# EAGLE design plc-3u-b-r1 (EAGLE 5.09)
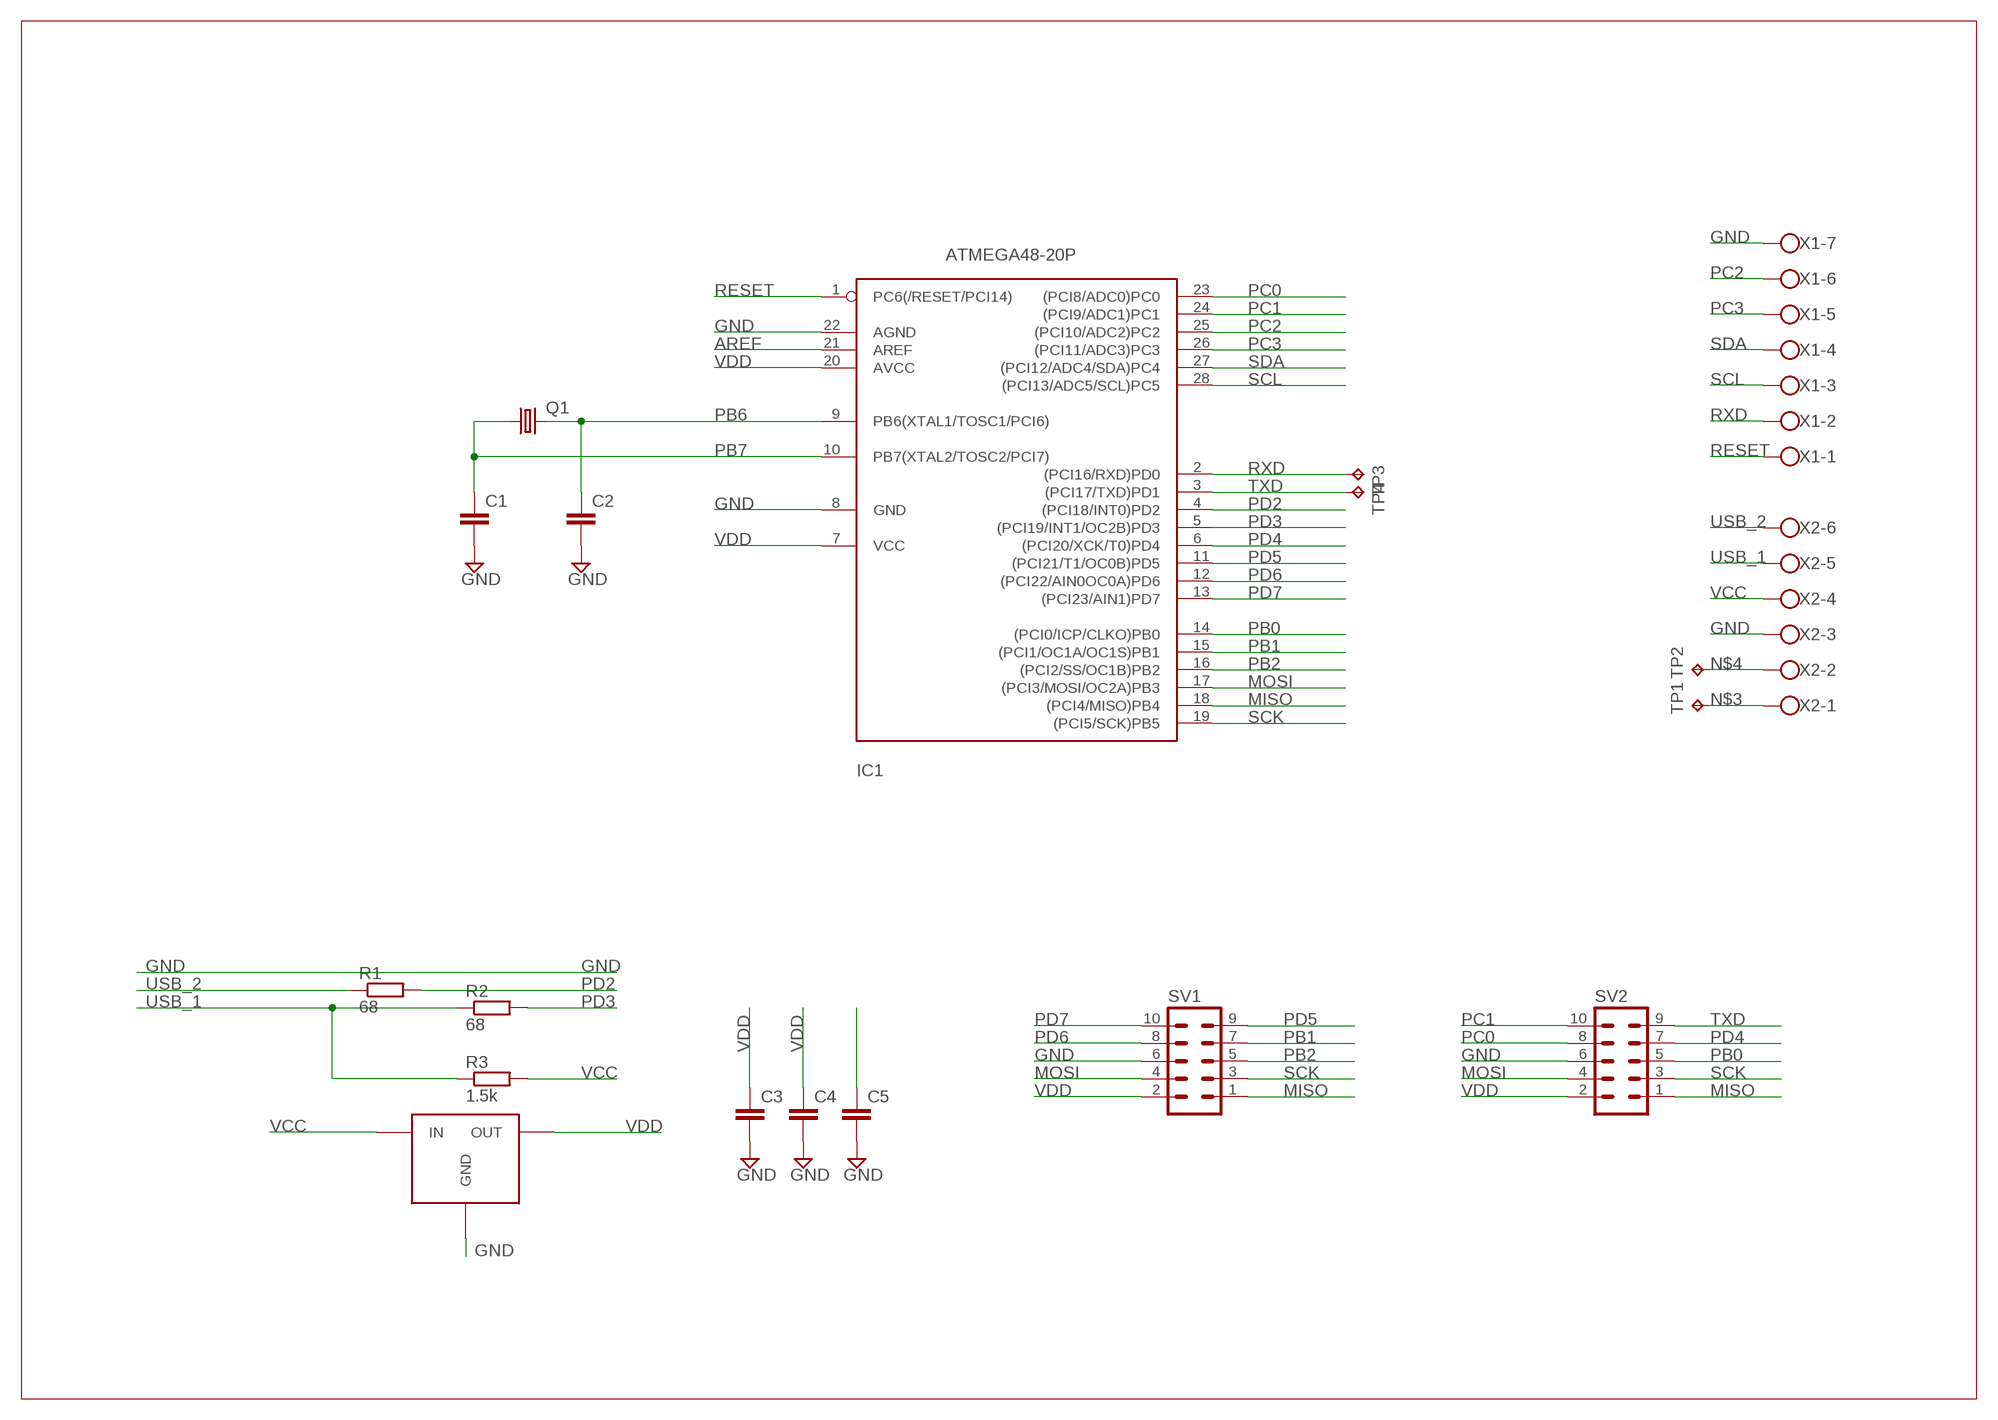
[diagram p0: schematic, sheet 1]

## Parts
C1  C-EUC0805  [C0805]
C2  C-EUC0805  [C0805]
C3  C-EUC1206  [C1206]
C4  C-EUC1206  [C1206]
C5  C-EUC1206  [C1206]
IC1  ATMEGA48-20P  [DIL28-3]
Q1  CRYSTALHC49S  [HC49/S]
R1  68  R-EU_R0805  [R0805]
R2  68  R-EU_R0805  [R0805]
R3  1.5k  R-EU_R0805  [R0805]
SV1  MA05-2  [MA05-2]
SV2  MA05-2  [MA05-2]
TP1  TPPAD1-13  [P1-13]
TP2  TPPAD1-13  [P1-13]
TP3  TPPAD1-13  [P1-13]
TP4  TPPAD1-13  [P1-13]
U$1  LF33CDT  [TO-252]
X1  W237-07P  [W237-7P]
X2  W237-06P  [W237-6P]

## Nets
AREF: IC1.21(AREF)
GND: C1.2 C2.2 C3.2 C4.2 C5.2 IC1.8(GND) IC1.22(AGND) SV1.6 SV2.6 U$1.3(GND) X1.7 X2.3
MISO: IC1.18((PCI4/MISO)PB4) SV1.1 SV2.1
MOSI: IC1.17((PCI3/MOSI/OC2A)PB3) SV1.4 SV2.4
N$1: C5.1
N$3: TP1.TP X2.1
N$4: TP2.TP X2.2
PB0: IC1.14((PCI0/ICP/CLKO)PB0) SV2.5
PB1: IC1.15((PCI1/OC1A/OC1S)PB1) SV1.7
PB2: IC1.16((PCI2/SS/OC1B)PB2) SV1.5
PB6: C2.1 IC1.9(PB6(XTAL1/TOSC1/PCI6)) Q1.2
PB7: C1.1 IC1.10(PB7(XTAL2/TOSC2/PCI7)) Q1.1
PC0: IC1.23((PCI8/ADC0)PC0) SV2.8
PC1: IC1.24((PCI9/ADC1)PC1) SV2.10
PC2: IC1.25((PCI10/ADC2)PC2) X1.6
PC3: IC1.26((PCI11/ADC3)PC3) X1.5
PD2: IC1.4((PCI18/INT0)PD2) R1.2
PD3: IC1.5((PCI19/INT1/OC2B)PD3) R2.2
PD4: IC1.6((PCI20/XCK/T0)PD4) SV2.7
PD5: IC1.11((PCI21/T1/OC0B)PD5) SV1.9
PD6: IC1.12((PCI22/AIN0OC0A)PD6) SV1.8
PD7: IC1.13((PCI23/AIN1)PD7) SV1.10
RESET: IC1.1(PC6(/RESET/PCI14)) X1.1
RXD: IC1.2((PCI16/RXD)PD0) TP3.TP X1.2
SCK: IC1.19((PCI5/SCK)PB5) SV1.3 SV2.3
SCL: IC1.28((PCI13/ADC5/SCL)PC5) X1.3
SDA: IC1.27((PCI12/ADC4/SDA)PC4) X1.4
TXD: IC1.3((PCI17/TXD)PD1) SV2.9 TP4.TP
USB_1: R2.1 R3.1 X2.5
USB_2: R1.1 X2.6
VCC: R3.2 U$1.1(IN) X2.4
VDD: C3.1 C4.1 IC1.7(VCC) IC1.20(AVCC) SV1.2 SV2.2 U$1.2(OUT)

## Library data of the parts
C1-C5 = rcl:C-EU: CAPACITOR, European symbol
IC1 = avr:ATMEGA48*P: MICROCONTROLLER 4 Kbytes FLASH 512 Bytes SRAM 256 Bytes EEPROM USART 8-channel 10 bit ADC
Q1 = crystal:CRYSTAL: CRYSTAL
R1-R3 = rcl:R-EU_: RESISTOR, European symbol
SV1 SV2 = con-lstb:MA05-2: PIN HEADER
TP1-TP4 = testpad:TP: Test pad
U$1 = my-to252:LF33CDT
X1 = con-wago-508:W237-07P: WAGO SREW CLAMP
X2 = con-wago-508:W237-06P: WAGO SREW CLAMP

## Board
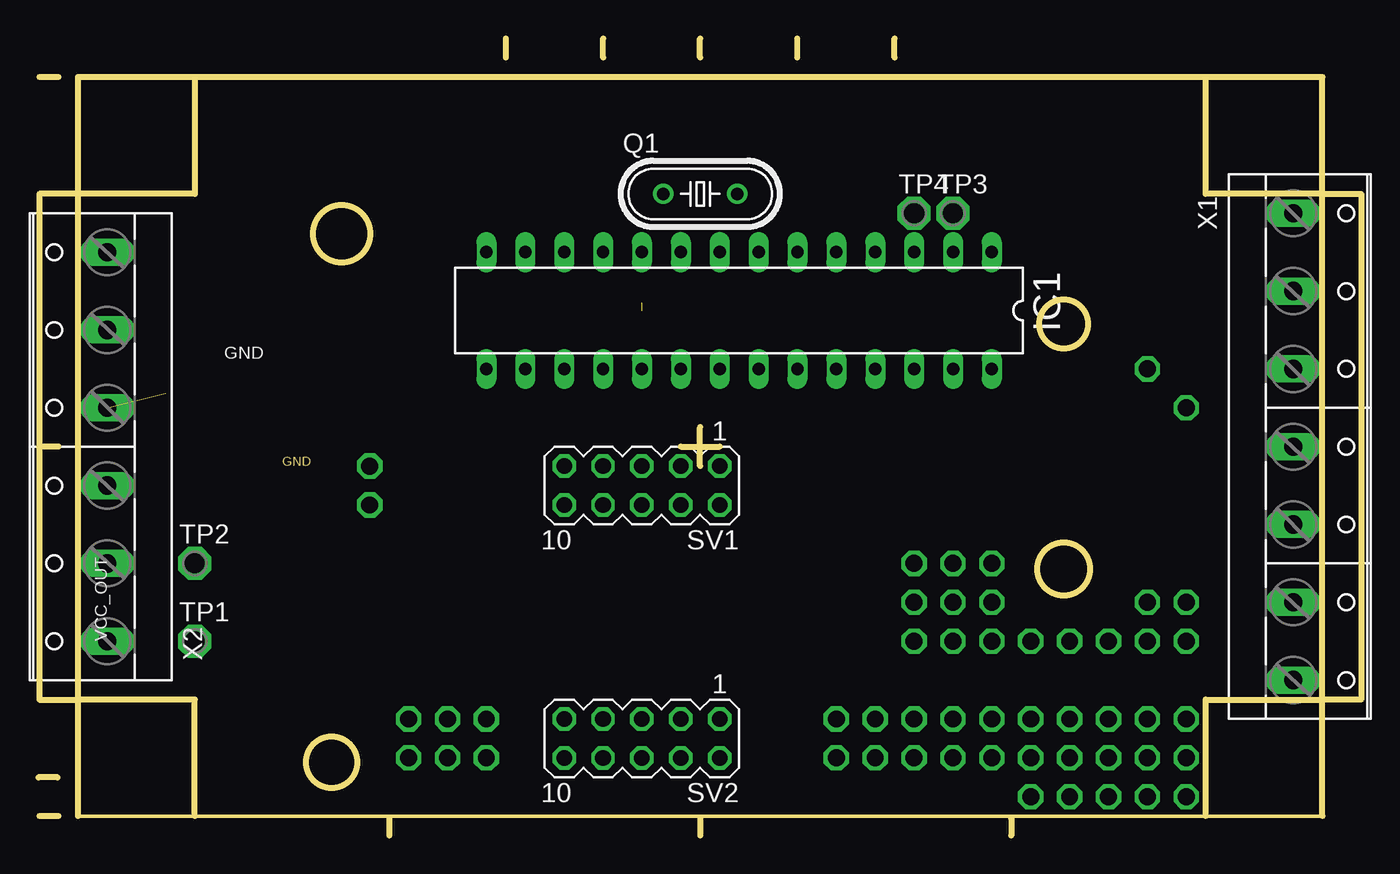
[diagram p1: board, top side]
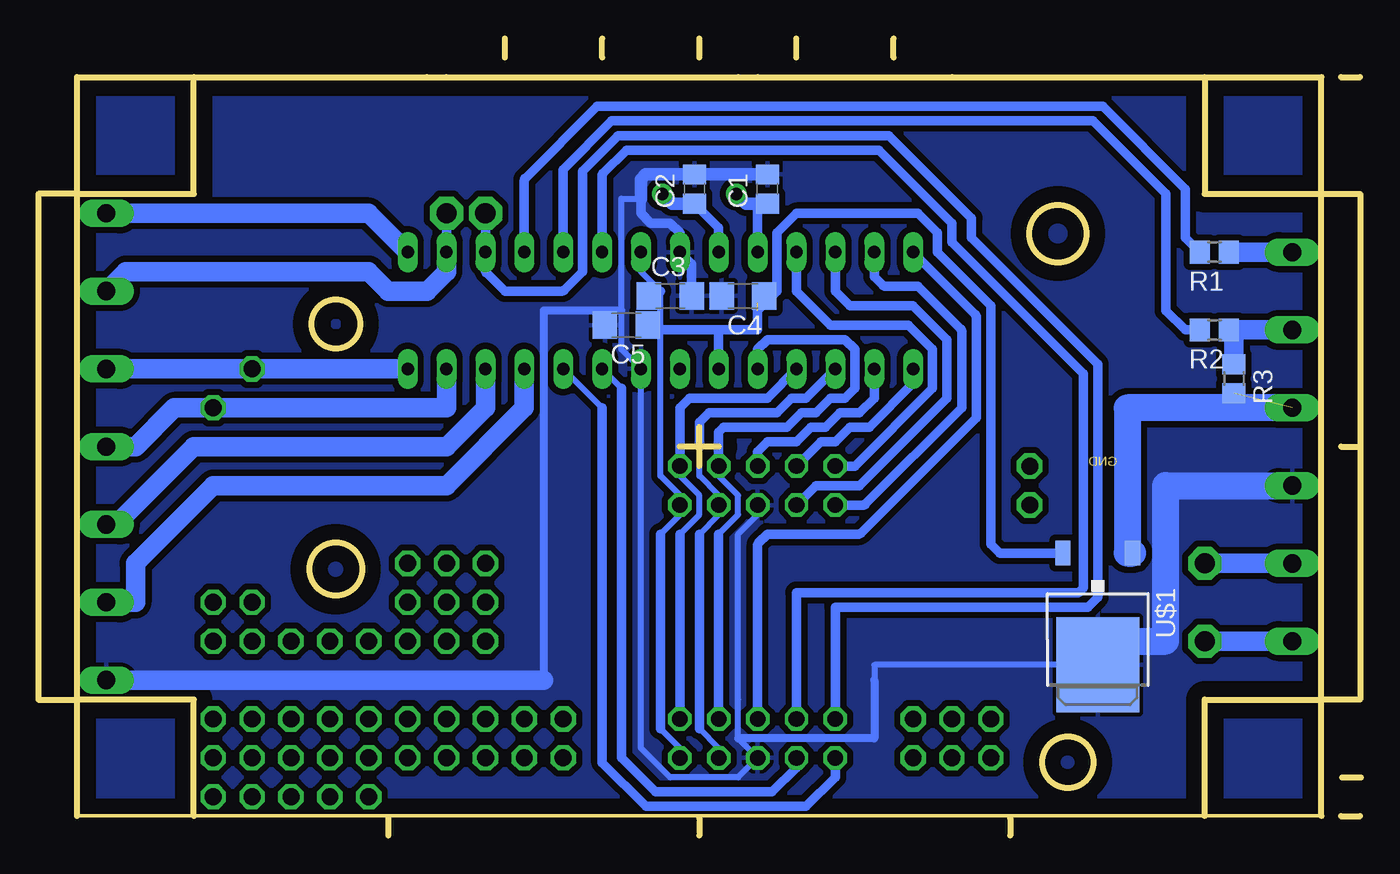
[diagram p2: board, bottom side, seen from below]

Size 86.42 x 52.07 mm. Coordinates in mm from the lower left corner, seen from the top.
Outline: 2.6,1.29 83.89,1.25
Outline: 43.24,1.13 43.24,0
Outline: 1.33,49.53 0.06,49.53
Outline: 1.33,1.27 0.06,1.27
Outline: 1.33,25.4 0.06,25.4
Outline: 41.97,25.4 44.51,25.4
Outline: 43.24,24.13 43.24,26.67
Outline: 2.6,1.27 2.6,8.89
Outline: 2.6,8.89 2.6,41.91
Outline: 2.6,41.91 2.6,49.53 10.22,49.53
Outline: 83.89,1.27 83.89,8.89
Outline: 83.89,8.89 83.89,41.91
Outline: 83.89,41.91 83.89,49.53 76.27,49.53
Outline: 76.27,49.53 61.02,49.53 59.75,49.53 40.7,49.53 39.43,49.53 26.73,49.53 10.22,49.53
Outline: 10.22,1.27 10.22,8.89 2.6,8.89
Outline: 76.27,1.27 76.27,8.89 83.89,8.89
Outline: 83.89,41.91 76.27,41.91 76.27,49.53
Outline: 10.22,49.53 10.22,41.91 2.6,41.91
Outline: 2.6,41.91 0.06,41.91 0.06,8.89 2.6,8.89
Outline: 83.89,41.91 86.42,41.91 86.42,8.89 83.89,8.89
Outline: 43.24,50.8 43.24,52.07
Outline: 49.59,50.8 49.59,52.07
Outline: 55.95,50.8 55.95,52.07
Outline: 36.89,50.8 36.89,52.07
Outline: 30.55,50.8 30.55,52.07
Outline: 1.27,3.81 0,3.81
Outline: 22.93,1.13 22.93,0
Outline: 63.56,1.13 63.56,0
Outline: circle at 19.81,39.32 radius 1.86
Outline: circle at 19.18,4.8 radius 1.66
Outline: circle at 67,17.4 radius 1.71
Outline: circle at 67,33.4 radius 1.57
Copper layers (1*16): Top 0.035mm / dielectric 1.5mm / Bottom 0.035mm
Design rules "default": minimum track width 10mil, minimum drill 24mil, track to track 8mil, track to pad 8mil, pad to pad 8mil, via to via 8mil, smd to smd 8mil, copper to edge 40mil, drill to drill 8mil, minimum pad ring 10mil, minimum via ring 8mil, stop-mask expansion 4mil, vias tented up to drill 0mil, thermal gap 10mil

### Footprints (pad centres in the part's own frame; a part is rotated, then mirrored left to right if it is on the bottom)
C0805 = smd 1.3 x 1.5: 1 -0.95,0; 2 0.95,0
C1206 = smd 1.6 x 1.8: 1 -1.4,0; 2 1.4,0
DIL28-3 = drill 0.813 long: 1 -16.51,-3.81; 2 -13.97,-3.81; 3 -11.43,-3.81; 4 -8.89,-3.81; 5 -6.35,-3.81; 6 -3.81,-3.81; 7 -1.27,-3.81; 8 1.27,-3.81; 9 3.81,-3.81; 10 6.35,-3.81; 11 8.89,-3.81; 12 11.43,-3.81; 13 13.97,-3.81; 14 16.51,-3.81; 15 16.51,3.81; 16 13.97,3.81; 17 11.43,3.81; 18 8.89,3.81; 19 6.35,3.81; 20 3.81,3.81; 21 1.27,3.81; 22 -1.27,3.81; 23 -3.81,3.81; 24 -6.35,3.81; 25 -8.89,3.81; 26 -11.43,3.81; 27 -13.97,3.81; 28 -16.51,3.81
HC49/S = drill 0.813 round: 1 -2.413,0; 2 2.413,0
R0805 = smd 1.3 x 1.5: 1 -0.95,0; 2 0.95,0
MA05-2 = drill 1.016 octagon: 1 -5.08,-1.27; 2 -5.08,1.27; 3 -2.54,-1.27; 4 -2.54,1.27; 5 0,-1.27; 6 0,1.27; 7 2.54,-1.27; 8 2.54,1.27; 9 5.08,-1.27; 10 5.08,1.27
P1-13 = drill 1.321 pad 2.159 octagon: TP 0,0
TO-252 = smd 1 x 1.6: 1 -2.28,-6.07; 2 2.28,-6.07 | smd 5.4 x 6.2: 3 0,1.23
W237-7P = drill 1.194 long: 1 -15.24,-0.635; 2 -10.16,-0.635; 3 -5.08,-0.635; 4 0,-0.635; 5 5.08,-0.635; 6 10.16,-0.635; 7 15.24,-0.635
W237-6P = drill 1.194 long: 1 -12.7,-0.635; 2 -7.62,-0.635; 3 -2.54,-0.635; 4 2.54,-0.635; 5 7.62,-0.635; 6 12.7,-0.635

### Placement (x,y rotation side)
C1  38.8,42.23 90 bottom
C2  43.56,42.23 90 bottom
C3  45.15,35.24 0 bottom
C4  40.39,35.24 180 bottom
C5  48.01,33.34 180 bottom
IC1  45.78,34.29 180 top
Q1  43.24,41.91 0 top
R1  9.59,38.1 180 bottom
R2  9.59,33.02 180 bottom
R3  8.32,29.84 270 bottom
SV1  39.43,22.86 180 top
SV2  39.43,6.35 180 top
TP1  10.22,12.7 0 top
TP2  10.22,17.78 0 top
TP3  59.75,40.64 0 top
TP4  57.21,40.64 0 top
U$1  17.21,12.38 180 bottom
X1  82.62,25.4 270 top
X2  3.88,25.4 90 top

### Tracks (layer width: path | path; a pad name or v marks a point on that pad's centre or on a via)
GND
  Bottom 0.406: SV1.6 39.43,20.95 40.7,19.68 40.7,8.89 40.7,6.35 SV2.6 40.7,3.81 45.15,3.81 47.05,5.71 IC1.22 48.32,31.75 48.32,34.29 48.32,41.59 47.05,41.59 | U$1.3 17.84,11.15 31.82,11.15 31.82,10.16
  Bottom 0.508: 53.4,10.16 53.4,34.29 49.59,34.29 | 49.59,34.29 48.32,34.29 49.59,34.29 | 31.82,10.16 31.82,6.35 40.7,6.35
  Bottom 0.61: 47.05,41.59 47.05,40.64 46.42,40.01 45.15,40.01 44.51,39.37 IC1.8 43.75,37.34 C3.2
  Bottom 0.813: C1.2 C2.2 46.74,43.18 47.05,42.86 47.05,41.59
  Bottom 1.27: 53.4,10.16 X1.7
  Bottom 1.778: X2.3 12.77,22.86 12.77,13.97 12.77,12.7 17.84,12.7 17.84,11.15
  pour Bottom (isolate 0.406): 2.6,1.27 83.89,1.27 83.89,49.53 2.6,49.53
MISO
  Bottom 0.406: 44.51,19.68 43.24,20.95 43.24,22.23 44.51,23.5 SV1.1
  Bottom 0.61: SV2.1 44.51,19.68 | SV1.1 44.51,27.94 43.88,28.57 38.8,28.57 IC1.18
MOSI
  Bottom 0.406: SV2.4 41.97,5.71 43.24,6.99 | 43.24,19.68 41.97,20.95 SV1.4 41.97,22.23 43.24,23.5 43.24,25.4
  Bottom 0.61: 43.24,6.99 43.24,19.68 | 43.24,25.4 43.24,26.99 42.61,27.62 38.16,27.62 37.21,28.57 36.26,28.57 IC1.17
N$2  (via drill 1.1)
  other vias: 75,15.24
N$3
  Bottom 1.27: X2.1 TP1.TP
N$4
  Bottom 1.27: X2.2 TP2.TP
N$5  (via drill 1.1)
  other vias: 72.45,15.24
N$6  (via drill 1.1)
  other vias: 72.45,12.7
N$7  (via drill 1.1)
  other vias: 75,12.7
N$8  (via drill 1.1)
  other vias: 69.92,12.7
N$9  (via drill 1.1)
  other vias: 67.38,12.7
N$10  (via drill 1.1)
  other vias: 64.83,12.7
N$11  (via drill 1.1)
  other vias: 62.29,12.7
N$12  (via drill 1.1)
  other vias: 59.75,12.7
N$13  (via drill 1.1)
  other vias: 57.21,12.7
N$14  (via drill 1.1)
  other vias: 57.21,15.24
N$15  (via drill 1.1)
  other vias: 57.21,17.78
N$16  (via drill 1.1)
  other vias: 59.75,17.78
N$17  (via drill 1.1)
  other vias: 62.29,17.78
N$18  (via drill 1.1)
  other vias: 62.29,15.24
N$19  (via drill 1.1)
  other vias: 59.75,15.24
N$20  (via drill 1.1)
  other vias: 62.29,7.62
N$21  (via drill 1.1)
  other vias: 62.29,5.08
N$22  (via drill 1.1)
  other vias: 59.75,5.08
N$23  (via drill 1.1)
  other vias: 59.75,7.62
N$24  (via drill 1.1)
  other vias: 57.21,7.62
N$25  (via drill 1.1)
  other vias: 57.21,5.08
N$26  (via drill 1.1)
  other vias: 54.67,5.08
N$27  (via drill 1.1)
  other vias: 54.67,7.62
N$28  (via drill 1.1)
  other vias: 52.13,7.62
N$29  (via drill 1.1)
  other vias: 52.13,5.08
N$30  (via drill 1.1)
  other vias: 64.83,7.62
N$31  (via drill 1.1)
  other vias: 67.38,7.62
N$32  (via drill 1.1)
  other vias: 69.92,7.62
N$33  (via drill 1.1)
  other vias: 72.45,7.62
N$34  (via drill 1.1)
  other vias: 75,7.62
N$35  (via drill 1.1)
  other vias: 75,5.08
N$36  (via drill 1.1)
  other vias: 75,2.54
N$37  (via drill 1.1)
  other vias: 72.45,2.54
N$38  (via drill 1.1)
  other vias: 69.92,2.54
N$39  (via drill 1.1)
  other vias: 67.38,2.54
N$40  (via drill 1.1)
  other vias: 64.83,2.54
N$41  (via drill 1.1)
  other vias: 64.83,5.08
N$42  (via drill 1.1)
  other vias: 67.38,5.08
N$43  (via drill 1.1)
  other vias: 69.92,5.08
N$44  (via drill 1.1)
  other vias: 72.45,5.08
N$45  (via drill 1.1)
  other vias: 29.28,7.62
N$46  (via drill 1.1)
  other vias: 26.73,7.62
N$47  (via drill 1.1)
  other vias: 24.2,7.62
N$48  (via drill 1.1)
  other vias: 24.2,5.08
N$49  (via drill 1.1)
  other vias: 26.73,5.08
N$50  (via drill 1.1)
  other vias: 29.28,5.08
N$51  (via drill 1.1)
  other vias: 21.66,21.59
N$52  (via drill 1.1)
  other vias: 21.66,24.13
PB0
  Bottom 0.61: SV2.5 39.43,18.95 arc45 39.36,19.12 38.8,19.68 32.87,19.68 arc-45 32.69,19.76 25.15,27.3 25.15,33.87 arc-45 25.22,34.05 IC1.14
PB1
  Bottom 0.61: SV1.7 35.31,25.72 34.35,25.72 33.4,26.67 32.13,26.67 29.28,29.53 IC1.15
PB2
  Bottom 0.61: SV1.5 39.43,25.08 38.8,25.72 36.89,25.72 35.94,26.67 34.99,26.67 34.04,27.62 32.77,27.62 31.82,28.57 IC1.16
PB6
  Bottom 0.61: IC1.9 41.97,39.69 C2.1
  Bottom 0.813: C2.1 45.02,41.28 Q1.2
PB7
  Bottom 0.61: IC1.10 39.43,41.28
  Bottom 0.813: C1.1 39.43,41.28 40.2,41.28 Q1.1
PC0
  Bottom 0.406: 48.32,29.21 IC1.23
  Bottom 0.61: 48.32,29.21 48.32,5.08 46.1,2.86 38.48,2.86 36.89,4.45 SV2.8
PC1
  Bottom 0.406: 49.59,27.94 IC1.24
  Bottom 0.61: 49.59,27.94 49.59,4.76 46.74,1.91 36.26,1.91 34.35,3.81 SV2.10
PC2
  Bottom 1.27: IC1.25 54.67,27.94 59.75,22.86 75,22.86 80.08,17.78 80.08,15.24 X1.6
PC3
  Bottom 1.27: IC1.26 57.21,27.94 59.75,25.4 76.27,25.4 81.34,20.32 X1.5
PD2
  Bottom 0.61: IC1.4 54.67,42.76 arc45 54.6,42.94 49.91,47.62 16.89,47.62 11.5,42.23 11.5,39.05 R1.2
PD3
  Bottom 0.61: IC1.5 52.13,43.5 48.96,46.67 17.53,46.67 12.77,41.91 12.77,34.29 11.5,33.02 R2.2
PD4
  Bottom 0.61: IC1.6 49.59,43.08 arc45 49.52,43.25 48.01,44.77 31.5,44.77 26.73,40.01 26.73,38.73 18.16,30.16 18.16,29.21 18.16,16.19 18.48,15.88 22.61,15.88 36.89,15.88 SV2.7
PD5
  Bottom 0.61: SV1.9 33.09,24.13 28,29.21 28,31.75 29.59,33.34 34.67,33.34 36.89,35.56 IC1.11
PD6
  Bottom 0.61: SV1.8 35.62,22.86 32.77,22.86 27.05,28.57 27.05,32.38 29.28,34.61 33.4,34.61 34.35,35.56 IC1.12
PD7
  Bottom 0.61: SV1.10 32.55,21.59 arc-45 32.38,21.66 26.1,27.94 26.1,32.91 arc-45 26.17,33.09 28.96,35.88 31.07,35.88 arc45 31.25,35.95 31.82,36.51 IC1.13
RESET
  Bottom 1.27: X1.1 64.83,40.64 IC1.1
RXD
  Bottom 0.61: IC1.2 TP3.TP
  Bottom 1.27: IC1.2 59.75,36.83 61.02,35.56 63.56,35.56 64.83,36.83 80.71,36.83 X1.2
SCK
  Bottom 0.406: 41.97,19.68 40.7,20.95 40.7,22.23 41.97,23.5 SV1.3 41.97,24.77
  Bottom 0.61: SV2.3 41.97,19.68 | 41.97,24.77 41.97,26.35 41.66,26.67 37.53,26.67 36.58,27.62 35.62,27.62 34.67,28.57 33.72,28.57 33.09,29.21 33.09,31.75 33.72,32.38 38.8,32.38 39.43,31.75 IC1.19
SCL  (via drill 1.1)
  Bottom 1.27: IC1.28 v72.45,30.48 X1.3
SDA  (via drill 1.1)
  Bottom 1.27: IC1.27 59.75,27.94 v75,27.94 77.54,27.94 80.08,25.4 X1.4
TXD
  Bottom 0.61: SV2.9 34.35,14.92 21.97,14.92 17.84,14.92 17.21,15.56 17.21,29.84 17.21,30.8 25.46,39.05 25.46,40.32 30.86,45.72 32.45,45.72 48.43,45.72 arc-45 48.61,45.65 50.86,43.39 50.86,36.83 52.06,35.63 arc45 52.24,35.56 55.95,35.56 57.14,36.76 arc45 57.21,36.94 IC1.3 TP4.TP
USB_1
  Bottom 1.27: X2.5 R2.1 8.32,32.7 R3.1
USB_2
  Bottom 1.27: X2.6 R1.1
VCC  (1 unrouted)
  Bottom 1.778: X2.4 15.29,27.94 15.29,18.45 U$1.1
VDD  (1 unrouted)
  Bottom 0.406: SV2.2 44.51,5.71 45.78,6.99 | 45.78,19.68 44.51,20.95 SV1.2 44.51,22.23 45.78,23.5 45.78,25.4 45.78,33.02 45.78,35.56 47.05,36.83 IC1.7
  Bottom 0.61: 45.78,6.99 45.78,19.68 | 41.97,33.02 IC1.20 | 45.78,33.02 41.97,33.02 | C3.1 46.1,35.24 45.78,35.56 | 39.43,34.29 38.16,35.56 38.16,39.37 36.89,40.64 29.28,40.64 28.96,40.64 27.69,39.37 27.69,38.1 24.2,34.61 24.2,19.03 23.62,18.45 U$1.2 | 41.97,33.02 39.43,33.02 39.43,34.8 C4.1

### Text on the board
Dimension: GND
tNames: GND | VCC_OUT
Measures: 49.53 | 39 | 36.83 | 33.4 | 25.4 | 48.26 | 16 | 20.32 | 17.4 | 4.8 | 3.81 | 1.27 | 0 | 16.89 | 20.32 | 40.64 | 60.96 | 64.39 | 81.28 | 47.5